# Altium schematic sheet CPU_and_EXPANSION_BUS.SchDoc
size A0; SheetNumber: 5; SheetTotal: 12
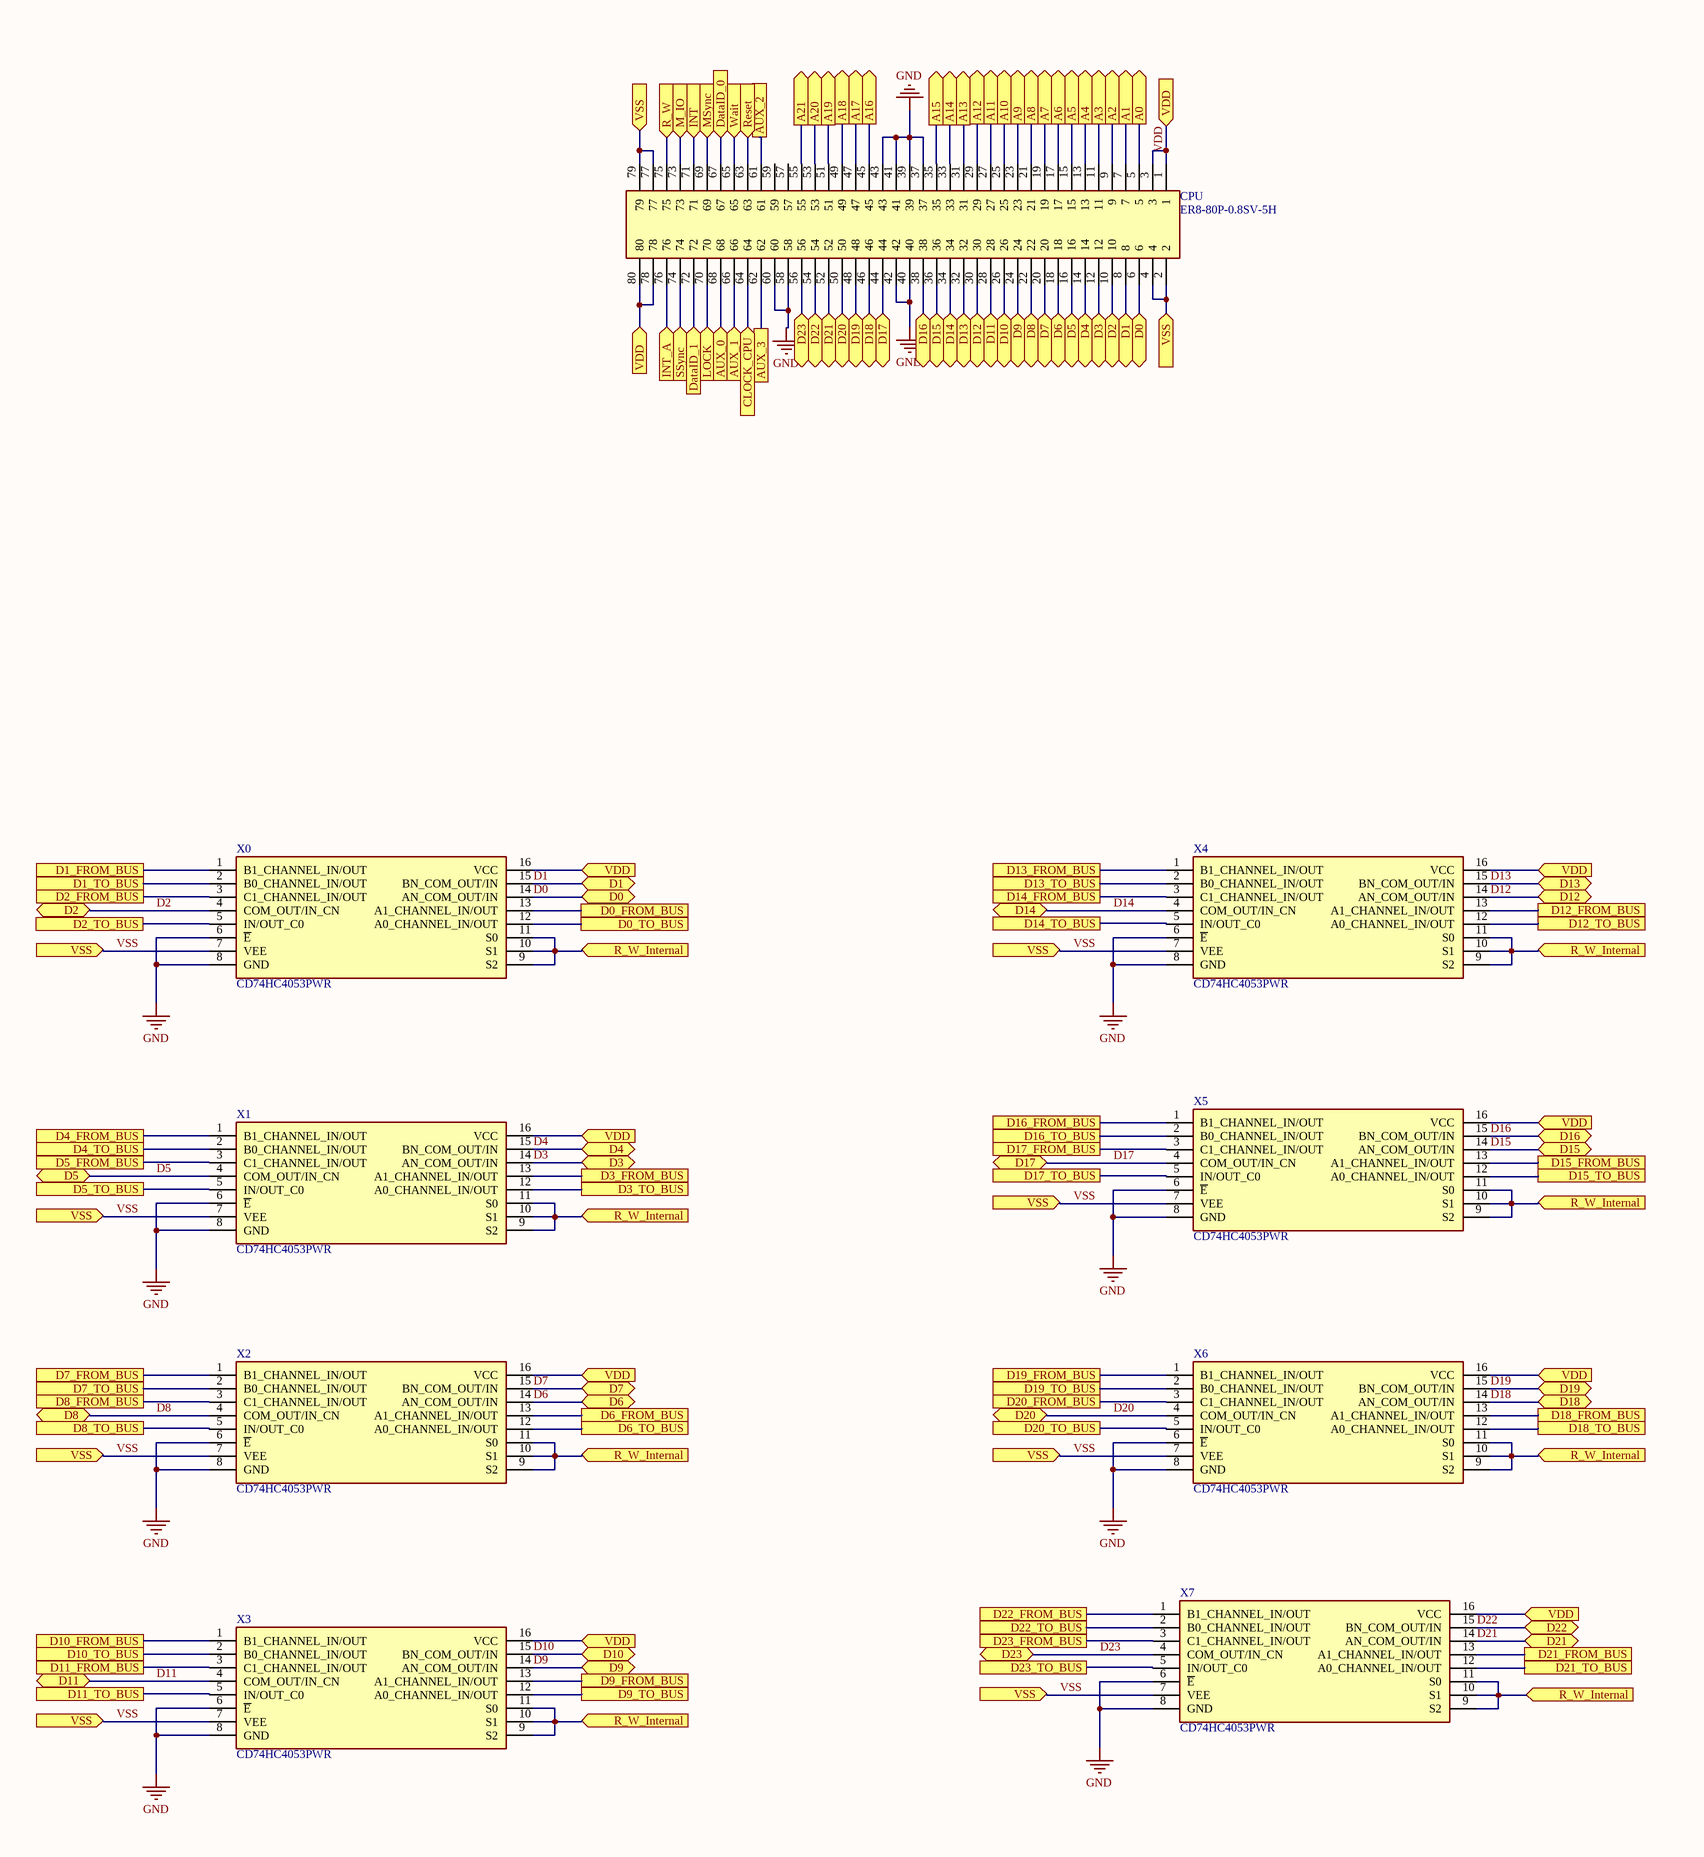
[diagram p0: CPU_and_EXPANSION_BUS.SchDoc, left]
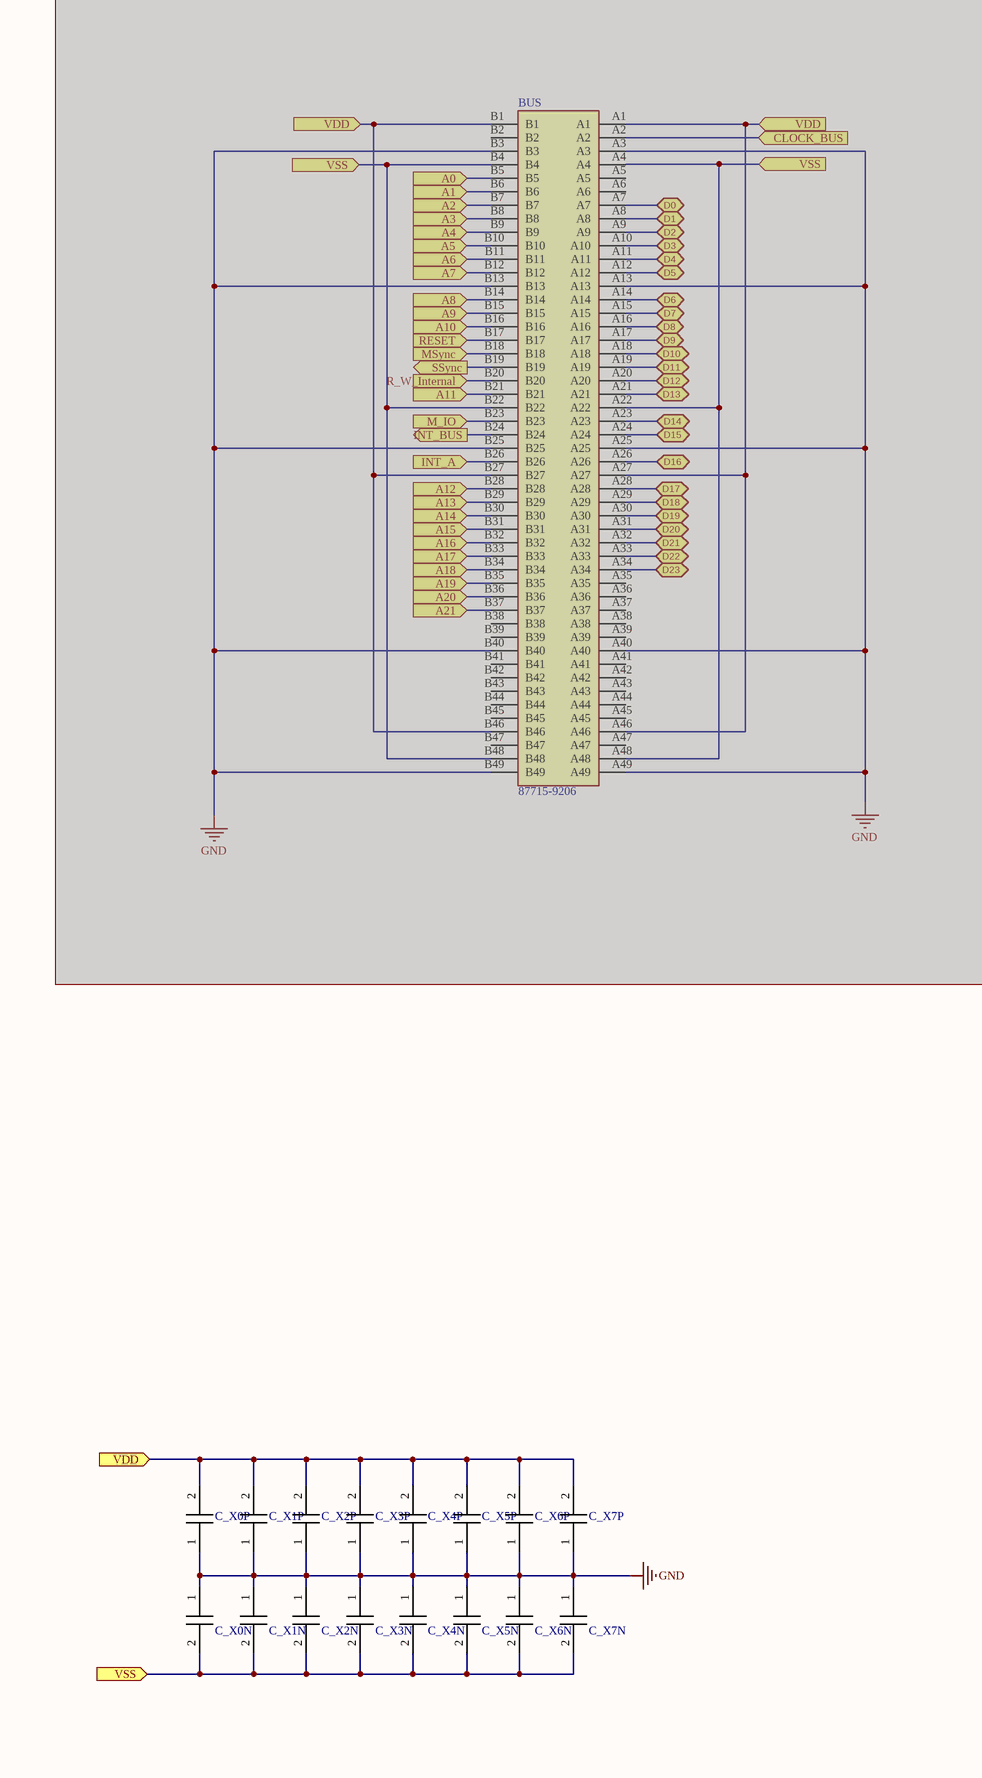
[diagram p1: CPU_and_EXPANSION_BUS.SchDoc, right]

## Parts
BUS  87715-9206  [877159206]  (masked out: inside a compile mask, not in the netlist)
C_X0N  GRM155R71C104JA88J  [CAPC1005X55N]  (value not drawn)
C_X0P  GRM155R71C104JA88J  [CAPC1005X55N]  (value not drawn)
C_X1N  GRM155R71C104JA88J  [CAPC1005X55N]  (value not drawn)
C_X1P  GRM155R71C104JA88J  [CAPC1005X55N]  (value not drawn)
C_X2N  GRM155R71C104JA88J  [CAPC1005X55N]  (value not drawn)
C_X2P  GRM155R71C104JA88J  [CAPC1005X55N]  (value not drawn)
C_X3N  GRM155R71C104JA88J  [CAPC1005X55N]  (value not drawn)
C_X3P  GRM155R71C104JA88J  [CAPC1005X55N]  (value not drawn)
C_X4N  GRM155R71C104JA88J  [CAPC1005X55N]  (value not drawn)
C_X4P  GRM155R71C104JA88J  [CAPC1005X55N]  (value not drawn)
C_X5N  GRM155R71C104JA88J  [CAPC1005X55N]  (value not drawn)
C_X5P  GRM155R71C104JA88J  [CAPC1005X55N]  (value not drawn)
C_X6N  GRM155R71C104JA88J  [CAPC1005X55N]  (value not drawn)
C_X6P  GRM155R71C104JA88J  [CAPC1005X55N]  (value not drawn)
C_X7N  GRM155R71C104JA88J  [CAPC1005X55N]  (value not drawn)
C_X7P  GRM155R71C104JA88J  [CAPC1005X55N]  (value not drawn)
CPU  ER8-80P-0.8SV-5H  [ER880P08SV5H]
X0  CD74HC4053PWR  [SOP65P640X120-16N]
X1  CD74HC4053PWR  [SOP65P640X120-16N]
X2  CD74HC4053PWR  [SOP65P640X120-16N]
X3  CD74HC4053PWR  [SOP65P640X120-16N]
X4  CD74HC4053PWR  [SOP65P640X120-16N]
X5  CD74HC4053PWR  [SOP65P640X120-16N]
X6  CD74HC4053PWR  [SOP65P640X120-16N]
X7  CD74HC4053PWR  [SOP65P640X120-16N]

## Ports
A0 (in), A0 (out), A1 (in), A1 (out), A2 (in), A2 (out), A3 (in), A3 (out), A4 (in), A4 (out), A5 (in), A5 (out), A6 (in), A6 (out), A7 (in), A7 (out), A8 (in), A8 (out), A9 (in), A9 (out), A10 (in), A10 (out), A11 (in), A11 (out), A12 (in), A12 (out), A13 (in), A13 (out), A14 (in), A14 (out), A15 (in), A15 (out), A16 (in), A16 (out), A17 (in), A17 (out), A18 (in), A18 (out), A19 (in), A19 (out), A20 (in), A20 (out), A21 (in), A21 (out), AUX_0 (in), AUX_1 (in), AUX_2, AUX_3, CLOCK_BUS (in), CLOCK_CPU (in), D0 (bidir), D0_FROM_BUS, D0_TO_BUS, D1 (bidir), D1_FROM_BUS, D1_TO_BUS, D2 (bidir), D2_FROM_BUS, D2_TO_BUS, D3 (bidir), D3_FROM_BUS, D3_TO_BUS, D4 (bidir), D4_FROM_BUS, D4_TO_BUS, D5 (bidir), D5_FROM_BUS, D5_TO_BUS, D6 (bidir), D6_FROM_BUS, D6_TO_BUS, D7 (bidir), D7_FROM_BUS, D7_TO_BUS, D8 (bidir), D8_FROM_BUS, D8_TO_BUS, D9 (bidir), D9_FROM_BUS, D9_TO_BUS, D10 (bidir), D10_FROM_BUS, D10_TO_BUS, D11 (bidir), D11_FROM_BUS, D11_TO_BUS, D12 (bidir), D12_FROM_BUS, D12_TO_BUS, D13 (bidir), D13_FROM_BUS, D13_TO_BUS, D14 (bidir), D14_FROM_BUS, D14_TO_BUS, D15 (bidir), D15_FROM_BUS, D15_TO_BUS, D16 (bidir), D16_FROM_BUS, D16_TO_BUS, D17 (bidir), D17_FROM_BUS, D17_TO_BUS, D18 (bidir), D18_FROM_BUS, D18_TO_BUS, D19 (bidir), D19_FROM_BUS, D19_TO_BUS, D20 (bidir), D20_FROM_BUS, D20_TO_BUS, D21 (bidir), D21_FROM_BUS, D21_TO_BUS, D22 (bidir), D22_FROM_BUS, D22_TO_BUS, D23 (bidir), D23_FROM_BUS, D23_TO_BUS, DataID_0 (in), DataID_1 (in), INT (in), INT_A (in), INT_BUS (out), LOCK (in), M_IO (in), MSync (in), R_W (in), R_W_Internal (in), Reset (in), RESET (in), SSync (in), SSync (out), VDD (in), VSS (in), Wait (in)

## Nets
GND: C_X0N.1 C_X0P.1 C_X1N.1 C_X1P.1 C_X2N.1 C_X2P.1 C_X3N.1 C_X3P.1 C_X4N.1 C_X4P.1 C_X5N.1 C_X5P.1 C_X6N.1 C_X6P.1 C_X7N.1 C_X7P.1 CPU.37 CPU.39 CPU.40 CPU.41 CPU.42 CPU.43 CPU.58 CPU.60 X0.6(~{E}) X0.8(GND) X1.6(~{E}) X1.8(GND) X2.6(~{E}) X2.8(GND) X3.6(~{E}) X3.8(GND) X4.6(~{E}) X4.8(GND) X5.6(~{E}) X5.8(GND) X6.6(~{E}) X6.8(GND) X7.6(~{E}) X7.8(GND)
A0: CPU.5 ; port A0
A1: CPU.7 ; port A1
A2: CPU.9 ; port A2
A3: CPU.11 ; port A3
A4: CPU.13 ; port A4
A5: CPU.15 ; port A5
A6: CPU.17 ; port A6
A7: CPU.19 ; port A7
A8: CPU.21 ; port A8
A9: CPU.23 ; port A9
A10: CPU.25 ; port A10
A11: CPU.27 ; port A11
A12: CPU.29 ; port A12
A13: CPU.31 ; port A13
A14: CPU.33 ; port A14
A15: CPU.35 ; port A15
A16: CPU.45 ; port A16
A17: CPU.47 ; port A17
A18: CPU.49 ; port A18
A19: CPU.51 ; port A19
A20: CPU.53 ; port A20
A21: CPU.55 ; port A21
AUX_0: CPU.68 ; port AUX_0
AUX_1: CPU.66 ; port AUX_1
AUX_2: CPU.61 ; port AUX_2
AUX_3: CPU.62 ; port AUX_3
CLOCK_CPU: CPU.64 ; port CLOCK_CPU
D0: CPU.6 X0.14(AN_COM_OUT/IN) ; port D0
D0_FROM_BUS: X0.13(A1_CHANNEL_IN/OUT) ; port D0_FROM_BUS
D0_TO_BUS: X0.12(A0_CHANNEL_IN/OUT) ; port D0_TO_BUS
D1: CPU.8 X0.15(BN_COM_OUT/IN) ; port D1
D1_FROM_BUS: X0.1(B1_CHANNEL_IN/OUT) ; port D1_FROM_BUS
D1_TO_BUS: X0.2(B0_CHANNEL_IN/OUT) ; port D1_TO_BUS
D2: CPU.10 X0.4(COM_OUT/IN_CN) ; port D2
D2_FROM_BUS: X0.3(C1_CHANNEL_IN/OUT) ; port D2_FROM_BUS
D2_TO_BUS: X0.5(IN/OUT_C0) ; port D2_TO_BUS
D3: CPU.12 X1.14(AN_COM_OUT/IN) ; port D3
D3_FROM_BUS: X1.13(A1_CHANNEL_IN/OUT) ; port D3_FROM_BUS
D3_TO_BUS: X1.12(A0_CHANNEL_IN/OUT) ; port D3_TO_BUS
D4: CPU.14 X1.15(BN_COM_OUT/IN) ; port D4
D4_FROM_BUS: X1.1(B1_CHANNEL_IN/OUT) ; port D4_FROM_BUS
D4_TO_BUS: X1.2(B0_CHANNEL_IN/OUT) ; port D4_TO_BUS
D5: CPU.16 X1.4(COM_OUT/IN_CN) ; port D5
D5_FROM_BUS: X1.3(C1_CHANNEL_IN/OUT) ; port D5_FROM_BUS
D5_TO_BUS: X1.5(IN/OUT_C0) ; port D5_TO_BUS
D6: CPU.18 X2.14(AN_COM_OUT/IN) ; port D6
D6_FROM_BUS: X2.13(A1_CHANNEL_IN/OUT) ; port D6_FROM_BUS
D6_TO_BUS: X2.12(A0_CHANNEL_IN/OUT) ; port D6_TO_BUS
D7: CPU.20 X2.15(BN_COM_OUT/IN) ; port D7
D7_FROM_BUS: X2.1(B1_CHANNEL_IN/OUT) ; port D7_FROM_BUS
D7_TO_BUS: X2.2(B0_CHANNEL_IN/OUT) ; port D7_TO_BUS
D8: CPU.22 X2.4(COM_OUT/IN_CN) ; port D8
D8_FROM_BUS: X2.3(C1_CHANNEL_IN/OUT) ; port D8_FROM_BUS
D8_TO_BUS: X2.5(IN/OUT_C0) ; port D8_TO_BUS
D9: CPU.24 X3.14(AN_COM_OUT/IN) ; port D9
D9_FROM_BUS: X3.13(A1_CHANNEL_IN/OUT) ; port D9_FROM_BUS
D9_TO_BUS: X3.12(A0_CHANNEL_IN/OUT) ; port D9_TO_BUS
D10: CPU.26 X3.15(BN_COM_OUT/IN) ; port D10
D10_FROM_BUS: X3.1(B1_CHANNEL_IN/OUT) ; port D10_FROM_BUS
D10_TO_BUS: X3.2(B0_CHANNEL_IN/OUT) ; port D10_TO_BUS
D11: CPU.28 X3.4(COM_OUT/IN_CN) ; port D11
D11_FROM_BUS: X3.3(C1_CHANNEL_IN/OUT) ; port D11_FROM_BUS
D11_TO_BUS: X3.5(IN/OUT_C0) ; port D11_TO_BUS
D12: CPU.30 X4.14(AN_COM_OUT/IN) ; port D12
D12_FROM_BUS: X4.13(A1_CHANNEL_IN/OUT) ; port D12_FROM_BUS
D12_TO_BUS: X4.12(A0_CHANNEL_IN/OUT) ; port D12_TO_BUS
D13: CPU.32 X4.15(BN_COM_OUT/IN) ; port D13
D13_FROM_BUS: X4.1(B1_CHANNEL_IN/OUT) ; port D13_FROM_BUS
D13_TO_BUS: X4.2(B0_CHANNEL_IN/OUT) ; port D13_TO_BUS
D14: CPU.34 X4.4(COM_OUT/IN_CN) ; port D14
D14_FROM_BUS: X4.3(C1_CHANNEL_IN/OUT) ; port D14_FROM_BUS
D14_TO_BUS: X4.5(IN/OUT_C0) ; port D14_TO_BUS
D15: CPU.36 X5.14(AN_COM_OUT/IN) ; port D15
D15_FROM_BUS: X5.13(A1_CHANNEL_IN/OUT) ; port D15_FROM_BUS
D15_TO_BUS: X5.12(A0_CHANNEL_IN/OUT) ; port D15_TO_BUS
D16: CPU.38 X5.15(BN_COM_OUT/IN) ; port D16
D16_FROM_BUS: X5.1(B1_CHANNEL_IN/OUT) ; port D16_FROM_BUS
D16_TO_BUS: X5.2(B0_CHANNEL_IN/OUT) ; port D16_TO_BUS
D17: CPU.44 X5.4(COM_OUT/IN_CN) ; port D17
D17_FROM_BUS: X5.3(C1_CHANNEL_IN/OUT) ; port D17_FROM_BUS
D17_TO_BUS: X5.5(IN/OUT_C0) ; port D17_TO_BUS
D18: CPU.46 X6.14(AN_COM_OUT/IN) ; port D18
D18_FROM_BUS: X6.13(A1_CHANNEL_IN/OUT) ; port D18_FROM_BUS
D18_TO_BUS: X6.12(A0_CHANNEL_IN/OUT) ; port D18_TO_BUS
D19: CPU.48 X6.15(BN_COM_OUT/IN) ; port D19
D19_FROM_BUS: X6.1(B1_CHANNEL_IN/OUT) ; port D19_FROM_BUS
D19_TO_BUS: X6.2(B0_CHANNEL_IN/OUT) ; port D19_TO_BUS
D20: CPU.50 X6.4(COM_OUT/IN_CN) ; port D20
D20_FROM_BUS: X6.3(C1_CHANNEL_IN/OUT) ; port D20_FROM_BUS
D20_TO_BUS: X6.5(IN/OUT_C0) ; port D20_TO_BUS
D21: CPU.52 X7.14(AN_COM_OUT/IN) ; port D21
D21_FROM_BUS: X7.13(A1_CHANNEL_IN/OUT) ; port D21_FROM_BUS
D21_TO_BUS: X7.12(A0_CHANNEL_IN/OUT) ; port D21_TO_BUS
D22: CPU.54 X7.15(BN_COM_OUT/IN) ; port D22
D22_FROM_BUS: X7.1(B1_CHANNEL_IN/OUT) ; port D22_FROM_BUS
D22_TO_BUS: X7.2(B0_CHANNEL_IN/OUT) ; port D22_TO_BUS
D23: CPU.56 X7.4(COM_OUT/IN_CN) ; port D23
D23_FROM_BUS: X7.3(C1_CHANNEL_IN/OUT) ; port D23_FROM_BUS
D23_TO_BUS: X7.5(IN/OUT_C0) ; port D23_TO_BUS
DataID_0: CPU.67 ; port DataID_0
DataID_1: CPU.72 ; port DataID_1
INT: CPU.71 ; port INT
INT_A: CPU.76 ; port INT_A
LOCK: CPU.70 ; port LOCK
M_IO: CPU.73 ; port M_IO
MSync: CPU.69 ; port MSync
R_W: CPU.75 ; port R_W
R_W_Internal: X0.9(S2) X0.10(S1) X0.11(S0) X1.9(S2) X1.10(S1) X1.11(S0) X2.9(S2) X2.10(S1) X2.11(S0) X3.9(S2) X3.10(S1) X3.11(S0) X4.9(S2) X4.10(S1) X4.11(S0) X5.9(S2) X5.10(S1) X5.11(S0) X6.9(S2) X6.10(S1) X6.11(S0) X7.9(S2) X7.10(S1) X7.11(S0) ; port R_W_Internal
Reset: CPU.63 ; port Reset
SSync: CPU.74 ; port SSync
VDD: C_X0P.2 C_X1P.2 C_X2P.2 C_X3P.2 C_X4P.2 C_X5P.2 C_X6P.2 C_X7P.2 CPU.1 CPU.3 CPU.78 CPU.80 X0.16(VCC) X1.16(VCC) X2.16(VCC) X3.16(VCC) X4.16(VCC) X5.16(VCC) X6.16(VCC) X7.16(VCC) ; port VDD
VSS: C_X0N.2 C_X1N.2 C_X2N.2 C_X3N.2 C_X4N.2 C_X5N.2 C_X6N.2 C_X7N.2 CPU.2 CPU.4 CPU.77 CPU.79 X0.7(VEE) X1.7(VEE) X2.7(VEE) X3.7(VEE) X4.7(VEE) X5.7(VEE) X6.7(VEE) X7.7(VEE) ; port VSS
Wait: CPU.65 ; port Wait

Not connected (* = marked no-connect by the designer): CPU 57 59

## Library data of the parts
BUS = 87715-9206: Connector; Manufacturer_Name: Molex; Datasheet Link: https://www.molex.com/pdm_docs/sd/877159100_sd.pdf; Height: 11.25mm; Manufacturer_Part_Number: 87715-9206; Mouser Part Number: 538-87715-9206; Mouser Price/Stock: https://www.mouser.co.uk/ProductDetail/Molex/87715-9206?qs=ei%2FvZTf36ZzJMI14HVKIJA%3D%3D
C_X0N C_X0P C_X1N C_X1P C_X2N C_X2P C_X3N C_X3P C_X4N C_X4P C_X5N C_X5P C_X6N C_X6P C_X7N C_X7P = GRM155R71C104JA88J: Capacitor; Manufacturer_Name: Murata Electronics; Datasheet Link: https://datasheet.datasheetarchive.com/originals/distributors/DKDS-10/191304.pdf; Height: 0.55mm; Manufacturer_Part_Number: GRM155R71C104JA88J; Mouser Part Number: 81-GRM155R71C104JA8J; Mouser Price/Stock: https://www.mouser.co.uk/ProductDetail/Murata-Electronics/GRM155R71C104JA88J?qs=hNud%2FORuBR1FShEh%252B0yzMw%3D%3D; Arrow Part Number: GRM155R71C104JA88J; Arrow Price/Stock: https://www.arrow.com/en/products/grm155r71c104ja88j/murata-manufacturing?region=nac
CPU = ER8-80P-0.8SV-5H: Connector; Manufacturer_Name: Hirose; Datasheet Link: https://datasheet.datasheetarchive.com/originals/distributors/DKDS-30/592323.pdf; Height: 8.905mm; Manufacturer_Part_Number: ER8-80P-0.8SV-5H; Mouser Part Number: 798-ER8-80P-0.8SV-5H; Mouser Price/Stock: https://www.mouser.com/Search/Refine.aspx?Keyword=798-ER8-80P-0.8SV-5H
X0-X7 = CD74HC4053PWR: Integrated Circuit; Manufacturer_Name: Texas Instruments; Datasheet Link: http://www.ti.com/lit/gpn/cd74hc4053; Height: 1.2mm; Manufacturer_Part_Number: CD74HC4053PWR; Mouser Part Number: 595-CD74HC4053PWR; Mouser Price/Stock: https://www.mouser.co.uk/ProductDetail/Texas-Instruments/CD74HC4053PWR?qs=DXdcjUGny5N%252BxCpA7Ml8gA%3D%3D; Arrow Part Number: CD74HC4053PWR; Arrow Price/Stock: https://www.arrow.com/en/products/cd74hc4053pwr/texas-instruments